# Altium project IMU_PCB_2024_VIAS02.PrjPcb
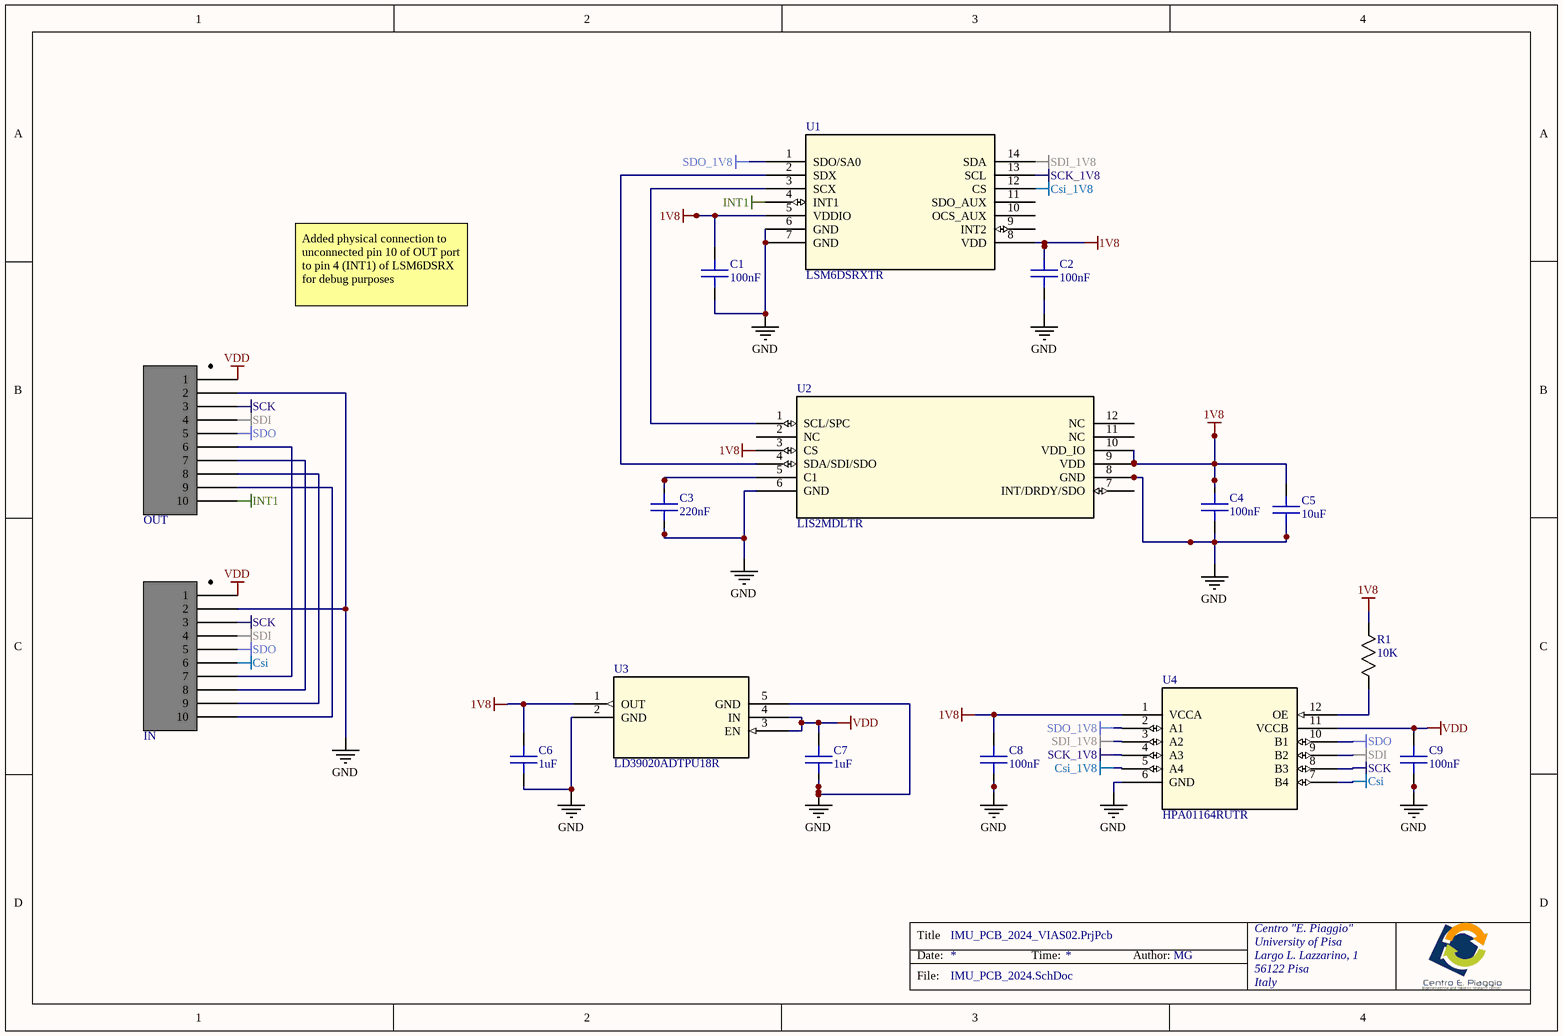
[diagram p0: IMU_PCB_2024.SchDoc]
1 sheet, 16 parts. Net scope: global (net labels, ports and power ports of the same name join across sheets).
Board file: IMU_PCB_20241_VIAS02.PcbDoc

## Sheet IMU_PCB_2024.SchDoc
size A4; PageSetup: Record=PageOptions|CenterHorizontal=True|CenterVertical=True|PrintScale=1.00|XCorrection=1.00|YCorrection=1.00|PrintKind=0|BorderSize=5000000|LeftOffset=0|BottomOffset=0|Orientation=2|PaperLength=1000|PaperWidth=1000|Scale=100|PaperSource=7|PrintQuality=-3|MediaType=1|DitherType=10|PrintScaleMode=1|PaperKind=A4|PaperIndex=9; Author: MG; Organization: Centro "E. Piaggio"; Address1: University of Pisa; Address2: Largo L. Lazzarino, 1; Address3: 56122 Pisa; Address4: Italy

### Parts
C1  100nF  [C0402]
C2  100nF  [C0402]
C3  220nF  [C0402]
C4  100nF  [C0402]
C5  10uF  [C0402]
C6  1uF  [C0402]
C7  1uF  [C0402]
C8  100nF  [C0402]
C9  100nF  [C0402]
IN  JST SM10B-XSRS-ETB  [SM10B-XSRS-ETB]  (value not drawn)
OUT  JST SM10B-XSRS-ETB  [SM10B-XSRS-ETB]  (value not drawn)
R1  10K  [R0402]
U1  LSM6DSRXTR  [LSM6]
U2  LIS2MDLTR  [LIS]
U3  LD39020ADTPU18R  [LD3]
U4  HPA01164RUTR  [RUT12]

### Nets
1V8: C1.2 C2.2 C4.2 C5.2 C6.2 C8.2 R1.2 U1.5(VDDIO) U1.8(VDD) U2.3(CS) U2.9(VDD) U2.10(VDD_IO) U3.1(OUT) U4.1(VCCA)
Csi: IN.6 U4.7(B4)
Csi_1V8: U1.12(CS) U4.5(A4)
GND: C1.1 C2.1 C3.1 C4.1 C5.1 C6.1 C7.1 C8.1 C9.1 IN.2 OUT.2 U1.6(GND) U1.7(GND) U2.6(GND) U2.8(GND) U3.2(GND) U3.5(GND) U4.6(GND)
INT1: OUT.10 U1.4(INT1)
SCK: IN.3 OUT.3 U4.8(B3)
SCK_1V8: U1.13(SCL) U4.4(A3)
SDI: IN.4 OUT.4 U4.9(B2)
SDI_1V8: U1.14(SDA) U4.3(A2)
SDO: IN.5 OUT.5 U4.10(B1)
SDO_1V8: U1.1(SDO/SA0) U4.2(A1)
VDD: C7.2 C9.2 IN.1 OUT.1 U3.3(EN) U3.4(IN) U4.11(VCCB)
NetC3_2: C3.2 U2.5(C1)
NetIN_7: IN.7 OUT.6
NetIN_8: IN.8 OUT.7
NetIN_9: IN.9 OUT.8
NetIN_10: IN.10 OUT.9
NetR1_1: R1.1 U4.12(OE)
NetU1_2: U1.2(SDX) U2.4(SDA/SDI/SDO)
NetU1_3: U1.3(SCX) U2.1(SCL/SPC)

Not connected (* = marked no-connect by the designer): U1 9(INT2) 10(OCS_AUX) 11(SDO_AUX); U2 2(NC) 7(INT/DRDY/SDO) 11(NC) 12(NC)

### Notes on the sheet
- Added physical connection to unconnected pin 10 of OUT port to pin 4 (INT1) of LSM6DSRX for debug purposes
- Title
- Date:
- File:
- Time:
- Author:

### Library data of the parts
C1-C9 = C0402: Mfr_Name: TDK
IN OUT = SM10B-XSRS-ETB: JST 10WAY angle XSR, SMT, 0.6mm, SM10B-XSRS-ETB; number_of_contacts: 10; contact_material: Copper; mounting_style: Through Hole; gender: Male; contact_plating: Tin; Product Range: XSR Series; Pitch Spacing: 0.6; No. of Rows: 1; Courant: 0.2A; Matériau du contact: Alliage de cuivre; Méthode de raccordement: Montage en surface; Numéro de série: SM10B; Orientation du corps: Droit; Tension: 30 V c.a./c.c.; Currency: EUR; Catalogue Price: 1,192; Product StockNumber: 820-1677; Product Status: IN_STOCK; Manufacturer: JST; Manufacturer Part Number: SM10B-XSRS-ETB; rohs_status: Compliant; Octopart Url: http://octopart.com/sm10b-xsrs-etb-jst-29522047; Seller Landing  Url: https://octopart-clicks.com/click/track?country=IT&ak=8157f166&sig=06796d5&sid=2402&ppid=29522047&vpid=200245201&ct=offers; OctopartID: 60b7a87f3daebf70; ComponentLink1URL: http://datasheet.octopart.com/SM10B-XSRS-ETB-JST-datasheet-12514066.pdf; ComponentLink1Description: http://datasheet.octopart.com/SM10B-XSRS-ETB-JST-datasheet-12514066.pdf; Supplier 1: Newark; RoHS: YES; Stock 1: 0; Contact Termination Type: Through Hole; No. of Contacts: 10; Contact Plating: Tin; Contact Material: Copper; ComponentLink2URL: http://www.farnell.com/datasheets/1706598.pdf; ComponentLink2Description: http://www.farnell.com/datasheets/1706598.pdf; Supplier 2: RS-Components; Category: Connecteurs; Stock 2: 0; Nombre de contacts: 10; Nombre de rangées: 1; Pas: 0.6mm; Séries: XSR; Type: Fil à carte; Minimum Order Quantity: 5; Supplier Part Number 1: 90W0858; Supplier Part Number 2: 820-1677
R1 = R0402: No Description Available; Mfr_Name: Stackpole International
U1 = LSM6DSRXTR: No Description Available; Mfr_Name: STMicroelectronics; RefDes: RefDes; Type: Type
U2 = LIS2MDLTR: No Description Available; Mfr_Name: STMicroelectronics; RefDes: RefDes; Type: Type
U3 = LD39020ADTPU18R: No Description Available; Mfr_Name: STMicroelectronics; RefDes: RefDes; Type: Type
U4 = HPA01164RUTR: No Description Available; Mfr_Name: Texas Instruments; RefDes: RefDes; Type: Type